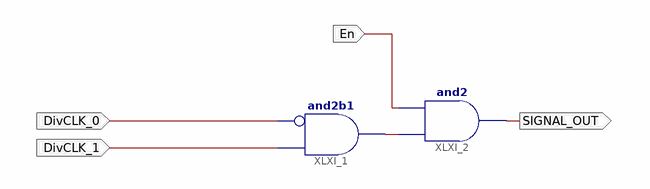
[diagram p0: schematic sheet 1]
// Xilinx ISE schematic YOGI_ET.sch (spartan3e) as structural Verilog: 2 symbols, 4 ports
module YOGI_ET (
  input  DivCLK_0,
  input  DivCLK_1,
  input  En,
  output SIGNAL_OUT
);

  wire XLXN_3;

  and XLXI_1 (XLXN_3, ~DivCLK_0, DivCLK_1);  // and2b1
  and XLXI_2 (SIGNAL_OUT, XLXN_3, En);
endmodule
